# Altium project PCB_AC_Dimmer.PrjPcb
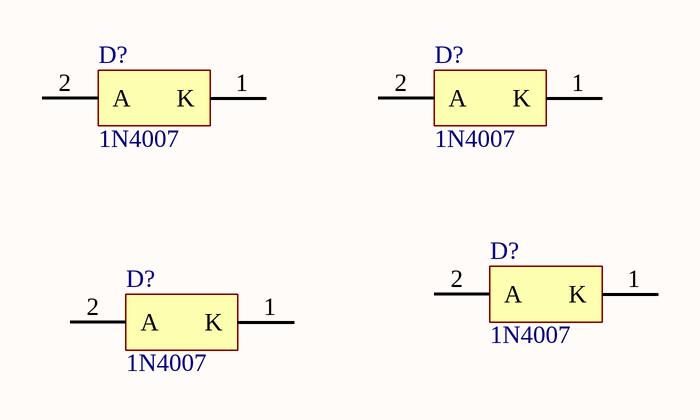
[diagram p0: AC_Dimmer_Schematic.SchDoc]
1 sheet, 4 parts. Net scope: global (net labels, ports and power ports of the same name join across sheets).

## Sheet AC_Dimmer_Schematic.SchDoc: string
size A; SheetNumber: 1; SheetTotal: 1

### Parts
(Parts that share a designator on the sheet are numbered #1, #2 ... from top to bottom, then left to right.)
D?#1  1N4007  [ONSC-AXIAL_LEAD-2-59-10_P]
D?#2  1N4007  [ONSC-AXIAL_LEAD-2-59-10_P]
D?#3  1N4007  [ONSC-AXIAL_LEAD-2-59-10_P]
D?#4  1N4007  [ONSC-AXIAL_LEAD-2-59-10_P]

### Nets

Not connected (* = marked no-connect by the designer): D?#1 1(K) 2(A); D?#2 1(K) 2(A); D?#3 1(K) 2(A); D?#4 1(K) 2(A)

### Library data of the parts
D?#1-D?#4 = CMP-0902-00142-1: Standard Recovery Rectifier, 2-Pin Axial_Lead, Pb-Free, Bulk Bag; Manufacturer: On Semiconductor; IO(rec) Max (A): 1; IFSM Max (A): 30; VRRM Max (V): 1000; ComponentLink3URL: http://www.onsemi.cn/pub_link/Collateral/59-10.PDF; PackageVersion: Rev. U, 02/2005; PackageDescription: 2-Pin, Axial Lead, Diameter 2.35 mm; PackageReference: AXIAL_LEAD-2-59-10; RoHS: TRUE; PartNumber: 1N4007; Packing: Bulk Bag; DatasheetVersion: Rev. 13; ComponentLink3Description: Package Specification; ComponentLink1Description: Manufacturer URL; ComponentLink2URL: http://www.onsemi.com/pub_link/Collateral/1N4001-D.PDF; ComponentLink1URL: http://www.onsemi.com/; Type: Standard Recovery; ComponentLink2Description: Datasheet; Mounting Technology: Through Hole